# EAGLE design Drum Kid (EAGLE 9.6.2)
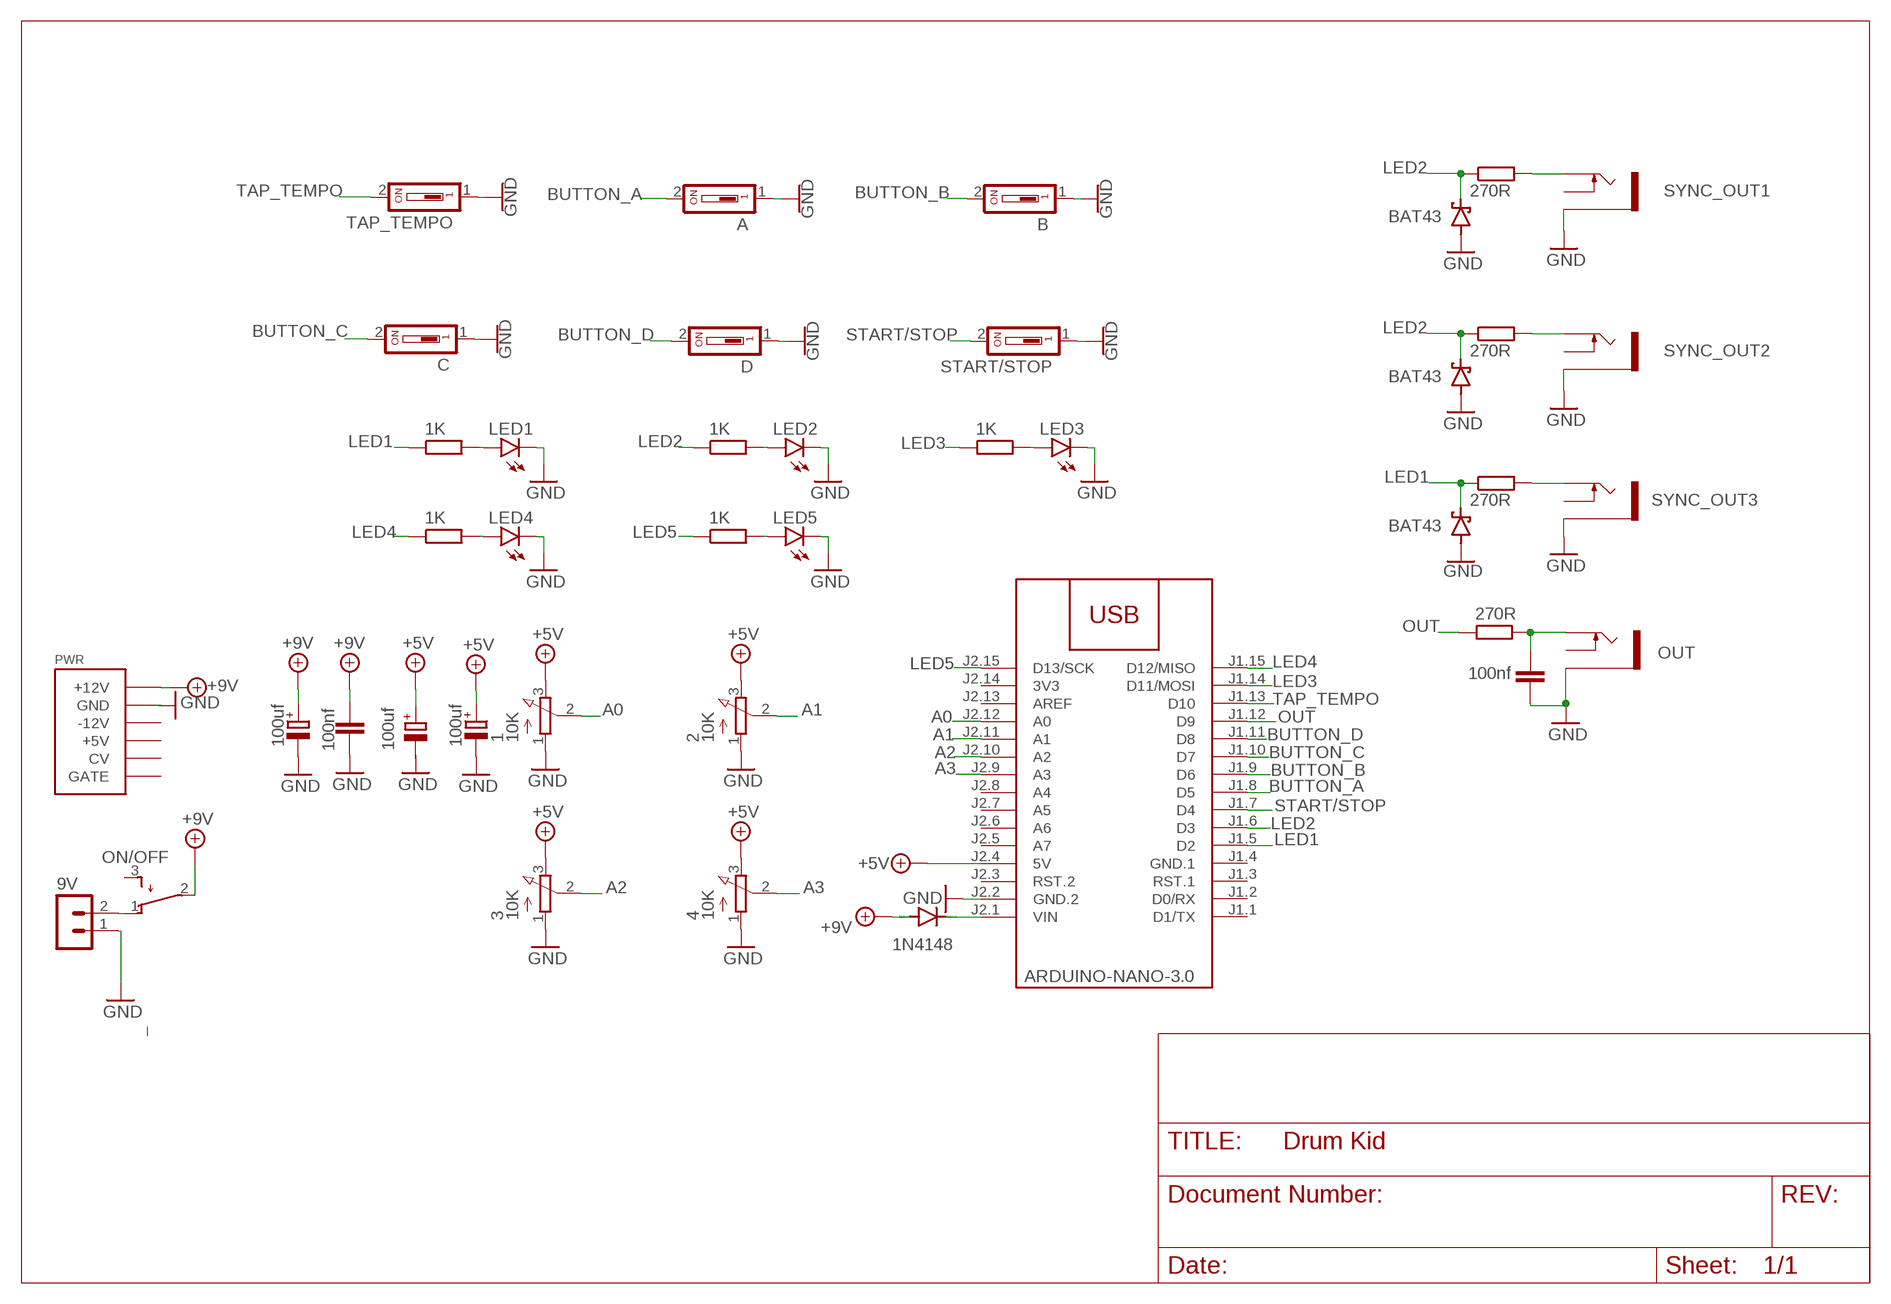
[diagram p0: schematic, sheet 1]

## Parts
1  10K  EVUF2A  [EVUF]
2  10K  EVUF2A  [EVUF]
3  10K  EVUF2A  [EVUF]
4  10K  EVUF2A  [EVUF]
9V  B2B-PH-K-S  [B2B-PH-K-S]
A  DS01  [DS-01]
B  DS01  [DS-01]
C  DS01  [DS-01]
C1  100nf  C-EU050-024X044  [C050-024X044]
C2  100uf  CPOL-EUE2-5  [E2-5]
C3  100uf  CPOL-EUE2-5  [E2-5]
C4  100nf  C-EU050-024X044  [C050-024X044]
C5  100uf  CPOL-EUE2,5-6E  [E2,5-6E]
D  DS01  [DS-01]
D1  BAT43  BAT42  [DO35-10]
D2  1N4148  1N4148DO35-7  [DO35-7]
D3  BAT43  BAT42  [DO35-10]
D4  BAT43  BAT42  [DO35-10]
LED1  LED3MM  [LED3MM]
LED2  LED3MM  [LED3MM]
LED3  LED3MM  [LED3MM]
LED4  LED3MM  [LED3MM]
LED5  LED3MM  [LED3MM]
M1  ARDUINO-NANO-3.0  [ARDUINO-NANO-3.0]
ON/OFF  TL32PO  [TL3XPO]
OUT  THONKICONNNEW  [WQP-PJ301M-12_JACK]
PWR  POWER  [POWER_16]
R1  1K  R-EU_0207/10  [0207/10]
R2  1K  R-EU_0207/10  [0207/10]
R3  1K  R-EU_0207/10  [0207/10]
R4  1K  R-EU_0207/10  [0207/10]
R5  1K  R-EU_0207/10  [0207/10]
R6  270R  R-EU_0207/10  [0207/10]
R7  270R  R-EU_0207/10  [0207/10]
R8  270R  R-EU_0207/10  [0207/10]
R9  270R  R-EU_0207/10  [0207/10]
START/STOP  DS01  [DS-01]
SYNC_OUT1  THONKICONNNEW  [WQP-PJ301M-12_JACK]
SYNC_OUT2  THONKICONNNEW  [WQP-PJ301M-12_JACK]
SYNC_OUT3  THONKICONNNEW  [WQP-PJ301M-12_JACK]
TAP_TEMPO  DS01  [DS-01]

## Nets
+5V: 1.3(E) 2.3(E) 3.3(E) 4.3(E) C2.+ C5.+ M1.J2.4(5V)
+9V: C1.1 C3.+ D2.A ON/OFF.2(P) PWR.9(+12V) PWR.10(+12V)
A0: 1.2(S) M1.J2.12(A0)
A1: 2.2(S) M1.J2.11(A1)
A2: 3.2(S) M1.J2.10(A2)
A3: 4.2(S) M1.J2.9(A3)
BUTTON_A: A.2 M1.J1.8(D5)
BUTTON_B: B.2 M1.J1.9(D6)
BUTTON_C: C.2 M1.J1.10(D7)
BUTTON_D: D.2 M1.J1.11(D8)
GND: 1.1(A) 2.1(A) 3.1(A) 4.1(A) 9V.1 A.1 B.1 C1.2 C2.- C3.- C4.2 C.1 D1.A D3.A D4.A D.1 LED1.K(C) LED2.K(C) LED3.K(C) LED4.K(C) LED5.K(C) M1.J2.2(GND.2) OUT.P$3_SLEEVE(SLEEVE) PWR.3(GND) PWR.4(GND) PWR.5(GND) PWR.6(GND) PWR.7(GND) PWR.8(GND) START/STOP.1 SYNC_OUT1.P$3_SLEEVE(SLEEVE) SYNC_OUT2.P$3_SLEEVE(SLEEVE) SYNC_OUT3.P$3_SLEEVE(SLEEVE) TAP_TEMPO.1
LED1: D3.C M1.J1.5(D2) R1.1 R6.1
LED2: D1.C D4.C M1.J1.6(D3) R3.1 R7.1 R9.1
LED3: M1.J1.14(D11/MOSI) R5.1
LED4: M1.J1.15(D12/MISO) R2.1
LED5: M1.J2.15(D13/SCK) R4.1
N$2: 9V.2 ON/OFF.1(O)
N$3: LED1.A R1.2
N$4: C4.1 OUT.P$1_TIP(TIP) R8.2
N$5: LED4.A R2.2
N$6: LED5.A R4.2
N$7: LED2.A R3.2
N$8: LED3.A R5.2
N$9: R7.2 SYNC_OUT1.P$1_TIP(TIP)
N$10: R6.2 SYNC_OUT3.P$1_TIP(TIP)
N$11: R9.2 SYNC_OUT2.P$1_TIP(TIP)
N$19: D2.C M1.J2.1(VIN)
OUT: M1.J1.12(D9) R8.1
START/STOP: M1.J1.7(D4) START/STOP.2
TAP_TEMPO: M1.J1.13(D10) TAP_TEMPO.2
Unconnected: C5.- M1.J1.1(D1/TX) M1.J1.2(D0/RX) M1.J1.3(RST.1) M1.J2.3(RST.2) M1.J2.5(A7) M1.J2.6(A6) M1.J2.7(A5) M1.J2.8(A4) M1.J2.13(AREF) ON/OFF.3(S) OUT.P$2_SWITCH(SWITCH) PWR.1(-12V) PWR.2(-12V) PWR.11(+5V) PWR.12(+5V) PWR.13(CV) PWR.14(CV) PWR.15(GATE) PWR.16(GATE) SYNC_OUT1.P$2_SWITCH(SWITCH) SYNC_OUT2.P$2_SWITCH(SWITCH) SYNC_OUT3.P$2_SWITCH(SWITCH)

## Power pins joined to a net without a drawn wire
3V3: M1.J2.14(3V3)
GND.1: M1.J1.4(GND.1)

## Library data of the parts
1-4 = pot:EVU: 9 mm Square Rotary Potentiometers Source: Panasonic
9V = con-JST PH:B2B-PH: JST PH series header 2.00mm pitch disconnectable crimp style connectors, vertical (side entry type), 2 pins
A B C D START/STOP TAP_TEMPO = 5mm SPST Switch:DS01: DIL/CODE SWITCH; OC_FARNELL: unknown; OC_NEWARK: unknown
C1 C4 = rcl:C-EU: CAPACITOR, European symbol; SPICEPREFIX: C
C2 C3 C5 = rcl:CPOL-EU: POLARIZED CAPACITOR, European symbol; SPICEPREFIX: C
D1 D3 D4 = diode:BAT42: DIODE barrier diode
D2 = diode:1N4148: DIODE high speed (Philips)
LED1-LED5 = led:LED: LED OSRAM: - CHIPLED LG R971, LG N971, LY N971, LG Q971, LY Q971, LO R971, LY R971 LH N974, LH R974 LS Q976, LO Q976, LY Q976 LO Q996 - Hyper CHIPLED LW Q18S LB Q993, LB Q99A, LB R99A - SideLED LS A670, LO A670, LY A670, LG A670, LP A670 LB A673, LV A673, LT A673, LW A673 LH A674 LY A675 LS A676, LA A676, LO A676, LY A676, LW A676 LS A679, LY A679, LG A679 - Hyper Micro SIDELED® LS Y876, LA Y876, LO Y876, LY Y876 LT Y87S - SmartLED LW L88C, LW L88S LB L89C, LB L89S, LG L890 LS L89K, LO L89K, LY L89K LS L896, LA L896, LO L896, LY L896 - TOPLED LS T670, LO T670, LY T670, LG T670, LP T670 LSG T670, LSP T670, LSY T670, LOP T670, LYG T670 LG T671, LOG T671, LSG T671 LB T673, LV T673, LT T673, LW T673 LH T674 LS T676, LA T676, LO T676, LY T676, LB T676, LH T676, LSB T676, LW T676 LB T67C, LV T67C, LT T67C, LS T67K, LO T67K, LY T67K, LW E67C LS E67B, LA E67B, LO E67B, LY E67B, LB E67C, LV E67C, LT E67C LW T67C LS T679, LY T679, LG T679 LS T770, LO T770, LY T770, LG T770, LP T770 LB T773, LV T773, LT T773, LW T773 LH T774 LS E675, LA E675, LY E675, LS T675 LS T776, LA T776, LO T776, LY T776, LB T776 LHGB T686 LT T68C, LB T68C - Hyper Mini TOPLED® LB M676 - Mini TOPLED Santana® LG M470 LS M47K, LO M47K, LY M47K Source: http://www.osram.convergy.de LUXEON: - LUMILED® LXK2-PW12-R00, LXK2-PW12-S00, LXK2-PW14-U00, LXK2-PW14-V00 LXK2-PM12-R00, LXK2-PM12-S00, LXK2-PM14-U00 LXK2-PE12-Q00, LXK2-PE12-R00, LXK2-PE12-S00, LXK2-PE14-T00, LXK2-PE14-U00 LXK2-PB12-K00, LXK2-PB12-L00, LXK2-PB12-M00, LXK2-PB14-N00, LXK2-PB14-P00, LXK2-PB14-Q00 LXK2-PR12-L00, LXK2-PR12-M00, LXK2-PR14-Q00, LXK2-PR14-R00 LXK2-PD12-Q00, LXK2-PD12-R00, LXK2-PD12-S00 LXK2-PH12-R00, LXK2-PH12-S00 LXK2-PL12-P00, LXK2-PL12-Q00, LXK2-PL12-R00 Source: www.luxeon.com KINGBRIGHT: KA-3528ASYC Source: www.kingbright.com
M1 = diy-modules:ARDUINO-NANO-3.0: Arduino Nano 3.0 and compatible devices More details available here: https://www.arduino.cc/en/Main/ArduinoBoardNano Click here to find device on ebay.com <http://www.ebay.com/sch/arduino+nano>
ON/OFF = switch:TL32PO: TINY SWITCH ON - MOM Source: http://www2.produktinfo.conrad.com/datenblaetter/700000-724999/705152-da-01-de-Subminiaturschalter_TL_36YO.pdf
OUT SYNC_OUT1-SYNC_OUT3 = MusicThingModular:THONKICONN: 3.5mm socket for Eurorack modular synths
PWR = EurorackModularParts:POWER
R1-R9 = rcl:R-EU_: RESISTOR, European symbol; SPICEPREFIX: R

## Board
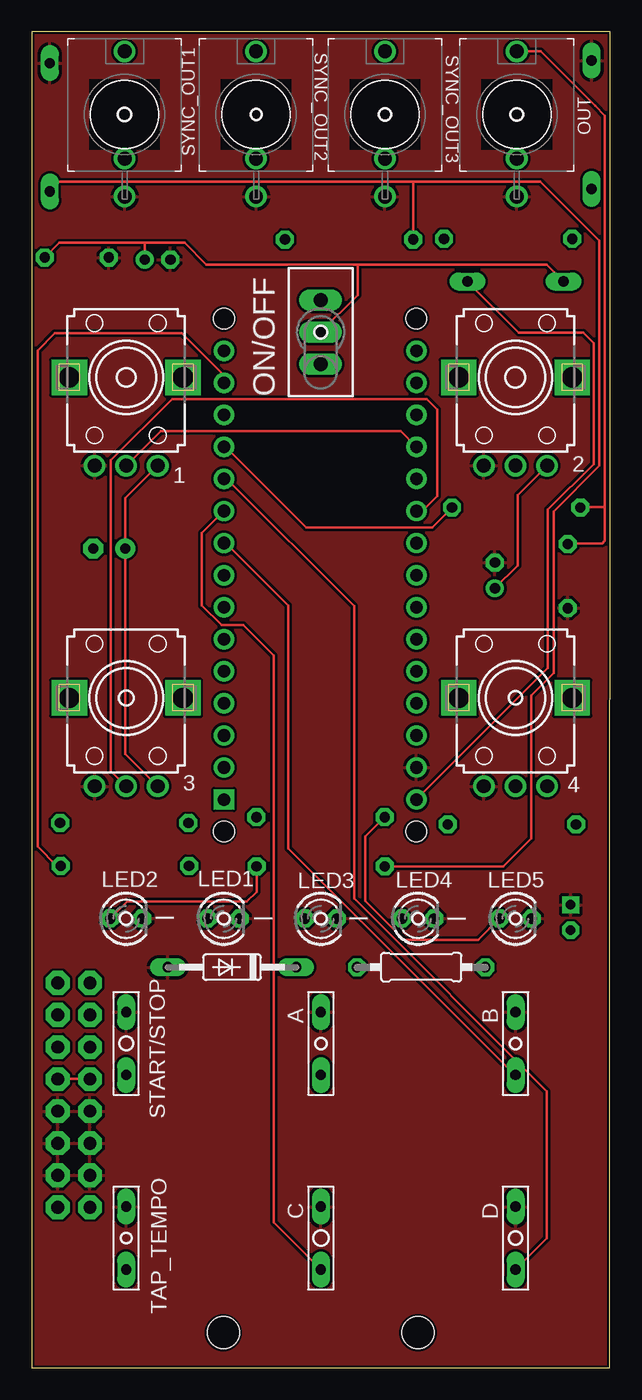
[diagram p1: board, top side]
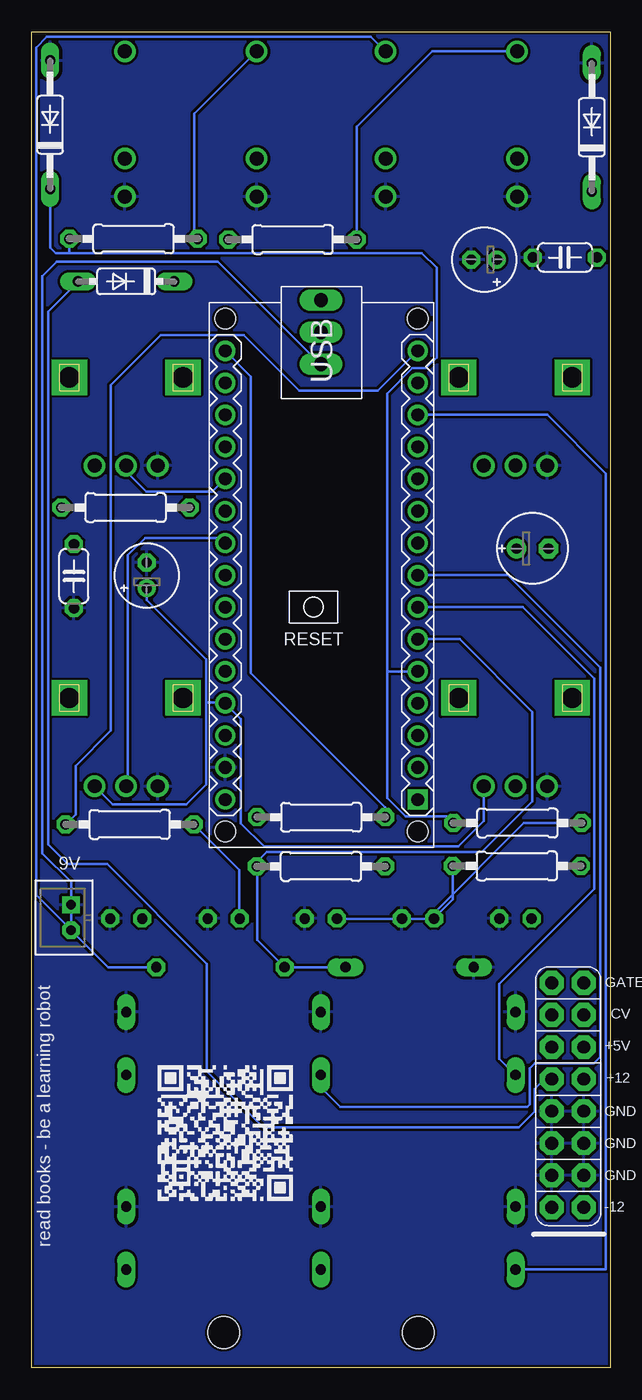
[diagram p2: board, bottom side, seen from below]

Size 45.82 x 105.88 mm. Coordinates in mm from the lower left corner, seen from the top.
Outline: 0,0 45.8,0 45.82,105.88 0,105.86 0,0
Copper layers (1*16): Top 0.035mm / dielectric 1.5mm / Bottom 0.035mm
Design rules "SparkFun": minimum track width 8mil, minimum drill 20mil, track to track 8mil, track to pad 8mil, pad to pad 8mil, via to via 8mil, smd to smd 8mil, copper to edge 8mil, drill to drill 8mil, minimum pad ring 12mil, minimum via ring 10mil, stop-mask expansion 4mil, vias tented up to drill 20mil, thermal gap 10mil
Holes 2.54 mm at 15.19,2.79 30.61,2.79

### Footprints (pad centres in the part's own frame; a part is rotated, then mirrored left to right if it is on the bottom)
EVUF = drill 1.1 pad 1.676: 1 -2.5,-7; 2 0,-7; 3 2.5,-7 | drill 1.6 pad 2.8 square: M1 4.5,0; M2 -4.5,0
B2B-PH-K-S = drill 0.75 pad 1.3 square: 1 1,0 | drill 0.75 pad 1.3 octagon: 2 -1,0
DS-01 = drill 0.813 long: 1 2.489,0; 2 -2.489,0
C050-024X044 = drill 0.813 octagon: 1 -2.54,0; 2 2.54,0
E2-5 = drill 0.813 pad 1.27: + -1.016,0 | drill 0.813 pad 1.27 octagon: - 1.016,0
E2,5-6E = drill 0.813 pad 1.575: + -1.27,0 | drill 0.813 pad 1.575 octagon: - 1.27,0
DO35-10 = drill 0.813 long: A 5.08,0; C -5.08,0
DO35-7 = drill 0.813 long: A 3.81,0; C -3.81,0
LED3MM = drill 0.813 octagon: A -1.27,0; K 1.27,0
ARDUINO-NANO-3.0 = drill 1 square: J1.1 17.78,7.62 | drill 1: J1.2 15.24,7.62; J1.3 12.7,7.62; J1.4 10.16,7.62; J1.5 7.62,7.62; J1.6 5.08,7.62; J1.7 2.54,7.62; J1.8 0,7.62; J1.9 -2.54,7.62; J1.10 -5.08,7.62; J1.11 -7.62,7.62; J1.12 -10.16,7.62; J1.13 -12.7,7.62; J1.14 -15.24,7.62; J1.15 -17.78,7.62; J2.1 17.78,-7.62; J2.2 15.24,-7.62; J2.3 12.7,-7.62; J2.4 10.16,-7.62; J2.5 7.62,-7.62; J2.6 5.08,-7.62; J2.7 2.54,-7.62; J2.8 0,-7.62; J2.9 -2.54,-7.62; J2.10 -5.08,-7.62; J2.11 -7.62,-7.62; J2.12 -10.16,-7.62; J2.13 -12.7,-7.62; J2.14 -15.24,-7.62; J2.15 -17.78,-7.62 | hole 1.651: -20.32,7.62; -20.32,-7.62; 20.32,-7.62; 20.32,7.62
TL3XPO = drill 1.1 pad 1.422 long: 1 -2.54,0; 2 0,0; 3 2.54,0
WQP-PJ301M-12_JACK = drill 1.1: P$1_TIP 0,5; P$2_SWITCH 0,-3.5; P$3_SLEEVE 0,-6.5
POWER_16 = drill 1.016 pad 1.88 octagon: 1 -8.89,-1.27; 2 -8.89,1.27; 3 -6.35,-1.27; 4 -6.35,1.27; 5 -3.81,-1.27; 6 -3.81,1.27; 7 -1.27,-1.27; 8 -1.27,1.27; 9 1.27,-1.27; 10 1.27,1.27; 11 3.81,-1.27; 12 3.81,1.27; 13 6.35,-1.27; 14 6.35,1.27; 15 8.89,-1.27; 16 8.89,1.27
0207/10 = drill 0.813 octagon: 1 -5.08,0; 2 5.08,0

### Placement (x,y rotation side)
1  7.49,78.49 0 top
2  38.33,78.49 0 top
3  7.49,53.09 0 top
4  38.33,53.09 0 top
9V  42.7,35.69 90 bottom
A  22.91,25.7 90 top
B  38.33,25.7 90 top
C  22.91,10.29 90 top
C1  3.58,87.99 180 bottom
C2  36.7,62.79 90 bottom
C3  9.98,87.81 180 bottom
C4  42.47,62.74 270 bottom
C5  6.15,64.92 0 bottom
D  38.33,10.29 90 top
D1  1.45,98.3 90 bottom
D2  38.33,86.08 180 bottom
D3  44.35,98.5 90 bottom
D4  15.88,31.75 180 top
LED1  15.21,35.6 0 top
LED2  7.49,35.6 0 top
LED3  22.91,35.6 0 top
LED4  30.61,35.6 0 top
LED5  38.33,35.6 0 top
M1  22.86,62.81 270 bottom
ON/OFF  22.9,82.07 90 top
OUT  38.43,99.31 0 top
PWR  3.35,21.62 90 bottom
R1  7.34,43.18 0 bottom
R2  38.05,43.07 0 bottom
R3  22.9,39.74 0 bottom
R4  22.89,43.64 180 bottom
R5  7.39,39.78 180 bottom
R6  37.74,89.46 0 bottom
R7  25.15,89.41 0 bottom
R8  38.38,68.17 180 bottom
R9  30.86,31.75 0 top
START/STOP  7.49,25.7 90 top
SYNC_OUT1  7.37,99.31 0 top
SYNC_OUT2  17.78,99.31 0 top
SYNC_OUT3  27.99,99.31 0 top
TAP_TEMPO  7.49,10.29 90 top

### Tracks (layer width: path | path; a pad name or v marks a point on that pad's centre or on a via)
+5V
  Top 0.203: 3.3 7.42,48.66 C5.+ 7.42,68.91 1.3 | 2.3 38.49,69.15 38.49,63.56 C2.+
  Bottom 0.203: C2.+ 36.7,60.86 31.98,56.13 31.98,52.71 | 31.98,52.71 31.98,46.23 33.55,44.65 39.4,44.65 4.3 | 3.3 9.99,43.32 12.01,41.3 27.41,41.3 29.23,43.13 29.23,51.41 M1.J2.4 30.53,52.71 31.98,52.71
+9V
  Top 0.203: D2.A 40.79,87.43 25.82,87.43 | 25.82,87.43 13.84,87.43 12.12,89.15 8.97,89.15 | ON/OFF.2 22.9,82.09 25.82,85.01 25.82,87.43 | PWR.9 PWR.10 | C1.1 2.21,89.15 8.97,89.15 | C3.+ 8.97,89.15
  Bottom 0.203: D2.A 44.51,83.71 44.51,41.48 42.95,39.93 39.82,39.93 31.93,32.03 31.93,23.49 27.48,19.05 7.24,19.05 5.97,20.32 5.97,22.1 5.18,22.88 PWR.10
A0
  Top 0.203: 1.2 10.23,74.22 29.23,74.22 M1.J2.12
A1
  Bottom 0.203: 2.2 38.33,71 36.74,69.42 31.5,69.42 M1.J2.11
A2
  Top 0.203: 3.2 6.27,47.3 6.27,67.77 6.28,67.76 6.28,71.92 11.13,76.76 31.32,76.76 32.13,75.95 32.13,69.09 30.94,67.89 M1.J2.10
A3
  Bottom 0.203: M1.J2.9 30.89,65.76 36.83,65.76 38.2,64.39 38.2,46.21 4.2
BUTTON_A
  Bottom 0.203: A.2 22.88,23.22 22.88,22.2 21.36,20.68 6.58,20.68 6.38,20.88 6.38,23.72 5.97,24.13 1.29,24.13 0.79,24.64 0.79,55.5 8.1,62.81 M1.J1.8
BUTTON_B
  Top 0.203: M1.J1.9 15.37,65.35 20.33,60.39 20.33,41.16 38.28,23.22 B.2
BUTTON_C
  Top 0.203: C.2 19.18,11.53 19.18,56.43 16.77,58.84 15.04,58.84 13.49,60.4 13.49,66.14 M1.J1.10
BUTTON_D
  Top 0.203: M1.J1.11 15.47,70.43 25.55,60.35 25.55,37.19 40.82,21.92 40.82,10.29 D.2
GND
  pour Top: 0,105.87 45.8,105.87 45.8,0 0,0
  pour Bottom: 0,105.87 45.8,105.87 45.8,0 0,0
LED1
  Bottom 0.203: M1.J1.5 17.65,55.19 | 17.65,55.19 17.65,77.21 15.67,79.2 14.61,79.2 13.74,80.06 13.74,87.17 14.91,88.34 42.8,88.34 | 17.65,55.19 17.65,45.16 16.18,43.69 12.93,43.69 R1.1 | D3.C 44.35,88.77 43.92,88.34 42.8,88.34 | R6.1 42.82,88.37 42.8,88.34
LED2
  Top 0.203: R3.1 37.38,39.74 39.57,41.94 39.57,53.29 41.35,55.07 41.35,67.87 44.96,71.48 44.96,89.3 40.27,93.98 30.25,93.98 | 30.25,93.98 2.21,93.98 D1.C | R7.1 30.23,93.95 30.25,93.98
  Bottom 0.203: M1.J1.6 11.91,57.73 6.15,51.97 6.15,44.9 10.16,40.89 27.2,40.89 27.95,40.15 | R3.1 27.98,40.12 27.95,40.15 | D4.C R9.1 27.95,33.92 27.95,40.15
LED3
  Top 0.203: M1.J1.14 15.24,78.66 11.91,81.99 1.85,81.99 0.48,80.62 0.48,41.3 2.01,39.78 R5.1
LED4
  Bottom 0.203: M1.J1.15 18.41,77.42 24.61,77.42 29.03,81.84 35.59,81.84 39.55,77.88 39.55,50.5 42.34,47.7 42.34,43.85 R2.1
LED5
  Bottom 0.203: R4.1 17.8,44.4 28.45,55.04 28.45,78.56 M1.J2.15
N$2
  Bottom 0.203: ON/OFF.1 22.95,79.53 31.08,87.66 43.81,87.66 44.98,86.49 44.98,40.78 42.7,38.5 9V.2
N$3
  Bottom 0.203: LED1.A 13.95,36.07 6.83,43.18 R1.2
N$4
  Top 0.203: R8.2 43.46,68.2 45.41,68.2 | OUT.P$1_TIP 40.34,104.31 44.65,100 45.41,99.23 45.41,68.2 | C4.1 42.52,65.33 45.19,65.33 45.41,65.56 45.41,68 45.41,68.2
N$5
  Bottom 0.203: LED4.A 29.36,35.62 29.36,39.46 R2.2
N$6
  Top 0.203: LED5.A 35.38,33.92 29.5,33.92 26.44,36.98 26.44,42.11 R4.2
N$7
  Top 0.203: LED2.A 7.57,36.94 17.06,36.94 17.82,37.71 R3.2
N$8
  Bottom 0.203: R5.2 12.47,37.11 13.99,35.59 21.37,35.59 21.64,35.85 LED3.A
N$9
  Bottom 0.203: R7.2 20.07,98.34 14.1,104.31 SYNC_OUT1.P$1_TIP
N$10
  Bottom 0.203: SYNC_OUT3.P$1_TIP 32.94,99.36 32.94,89.74 R6.2
N$11
  Bottom 0.203: R9.2 39.75,31.75 45.47,37.47 45.47,104.61 44.6,105.47 18.94,105.47 SYNC_OUT2.P$1_TIP
N$19
  Top 0.203: M1.J2.1 40.89,55.45 40.89,68 44.53,71.63 44.53,81.18 43.69,82.02 38.58,82.02 D2.C
OUT
  Top 0.203: M1.J1.12 15.37,72.97 21.74,66.6 31.73,66.6 R8.1
START/STOP
  Bottom 0.203: M1.J1.7 6.91,60.27 1.25,54.61 1.25,37.95 8.76,30.43 8.76,24.49 START/STOP.2
TAP_TEMPO
  Bottom 0.203: M1.J1.13 4.98,75.51 0.33,70.87 0.33,7.8 TAP_TEMPO.2

### Text on the board
tPlace: _ | _ | _ | _
bPlace: read books - be a learning robot